# EAGLE design bootloader_burner (EAGLE 9.6.2)
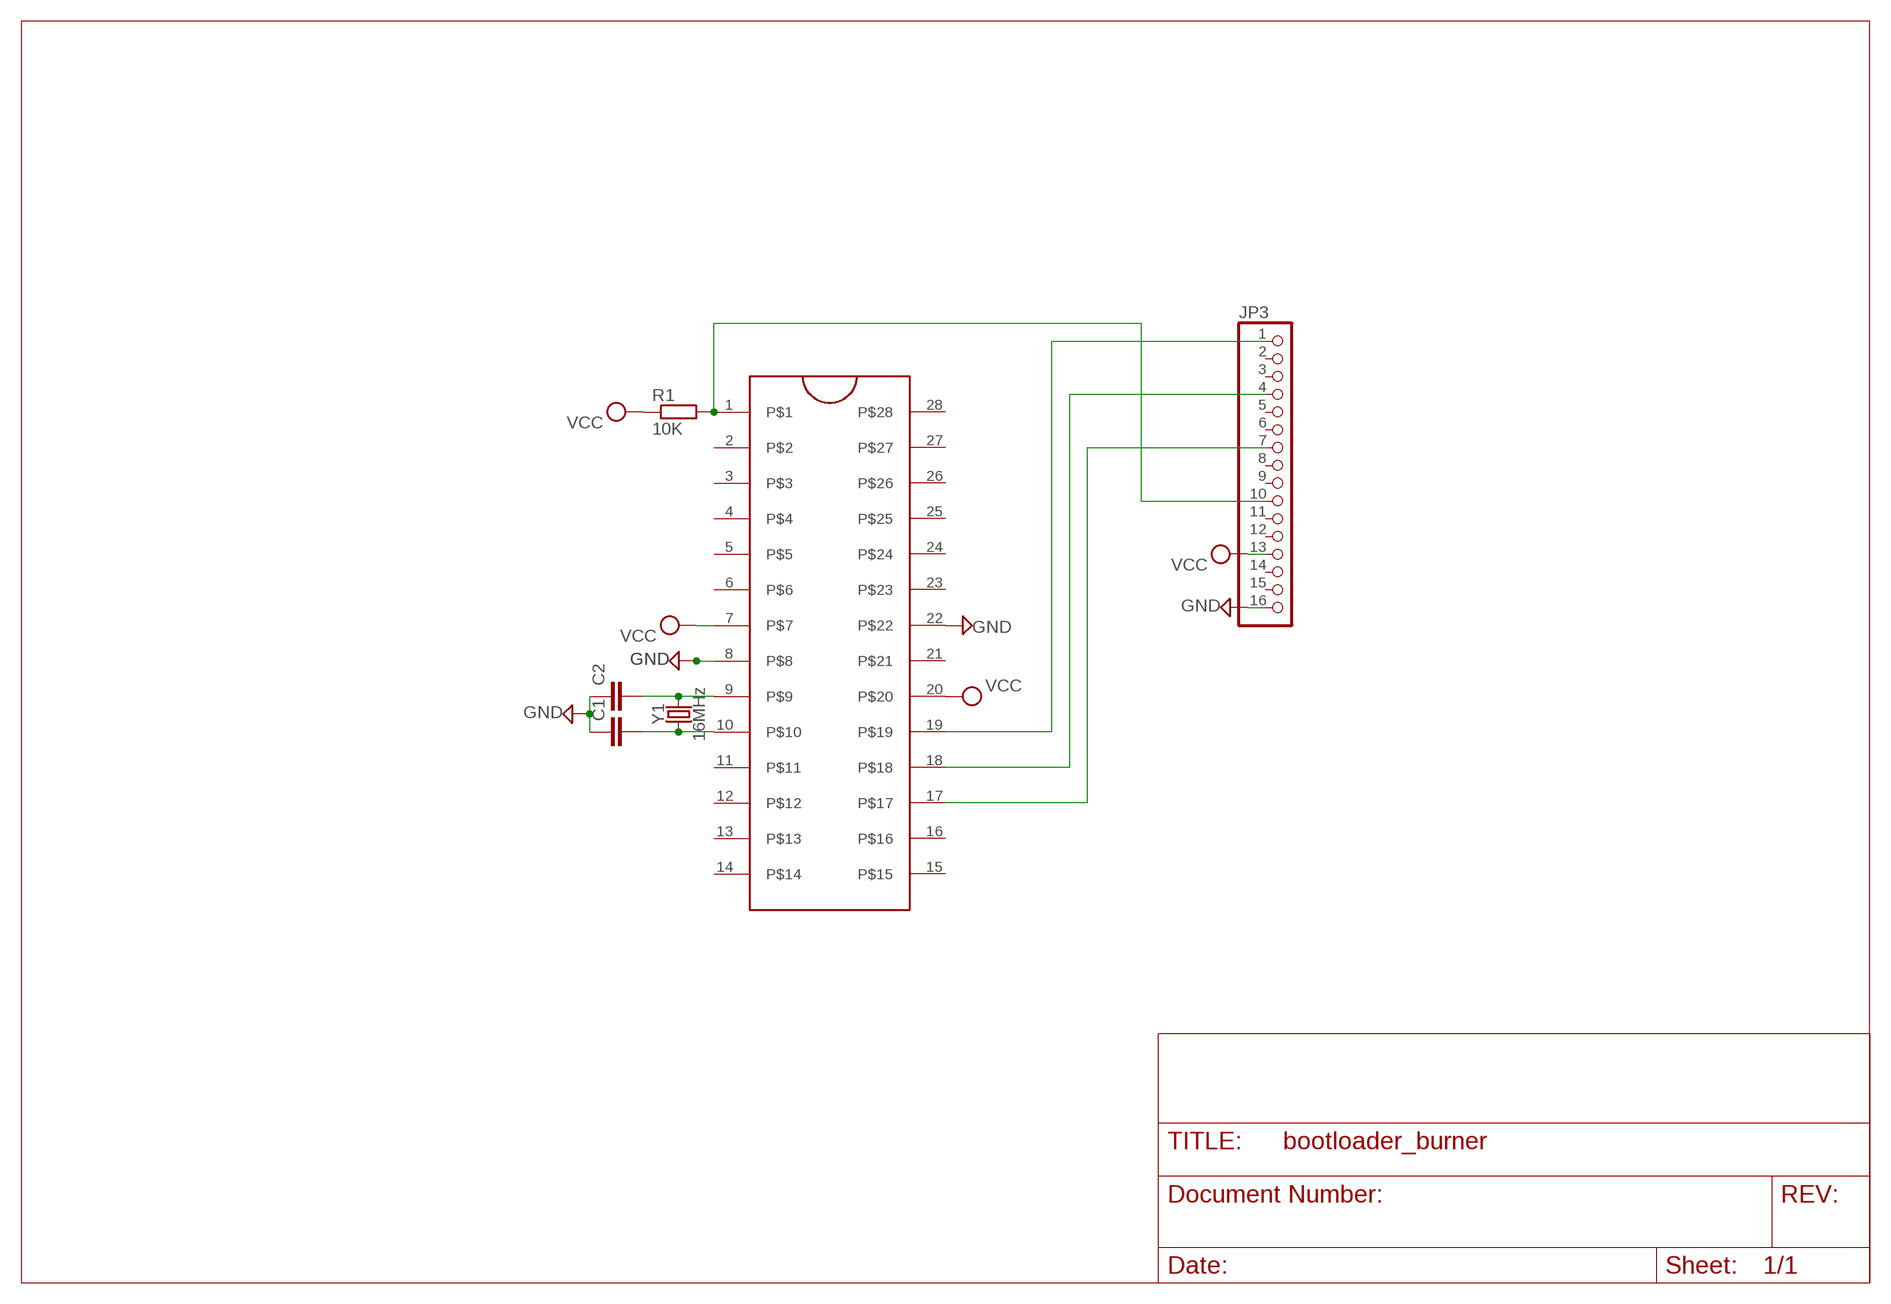
[diagram p0: schematic, sheet 1]

## Parts
C1  C-EU050-030X075  [C050-030X075]
C2  C-EU050-030X075  [C050-030X075]
J1  ZIFSOCKET-28-3"  [DIL28-3-ZIF_SOCKET]
JP3  PINHD-1X16  [1X16]
R1  10K  R-EU_0207/10  [0207/10]
Y1  16MHz  CRYSTAL-16MHZPTH-HC49US  [HC49US]

## Nets
GND: C1.1 C2.1 J1.8 J1.22 JP3.16
N$4: C2.2 J1.9 Y1.2
N$5: C1.2 J1.10 Y1.1
PIN10ARDUINO: J1.1 JP3.10 R1.2
PIN11ARDUINO: J1.17 JP3.7
PIN12ARDUINO: J1.18 JP3.4
PIN13ARDUINO: J1.19 JP3.1
VCC: J1.7 J1.20 JP3.13 R1.1
Unconnected: J1.2 J1.3 J1.4 J1.5 J1.6 J1.11 J1.12 J1.13 J1.14 J1.15 J1.16 J1.21 J1.23 J1.24 J1.25 J1.26 J1.27 J1.28 JP3.2 JP3.3 JP3.5 JP3.6 JP3.8 JP3.9 JP3.11 JP3.12 JP3.14 JP3.15

## Library data of the parts
C1 C2 = rcl:C-EU: CAPACITOR, European symbol; SPICEPREFIX: C
J1 = SparkFun-Connectors:ZIFSOCKET-28-3: ZIF Socket 28-Pin 0.3" Lever-action ZIF socket for 28-pin ICs SparkFun Products: ZIF Socket 28-Pin <https://www.sparkfun.com/products/9175>; PROD_ID: CONN-10960; SF_ID: PRT-09175
JP3 = pinhead:PINHD-1X16: PIN HEADER
R1 = rcl:R-EU_: RESISTOR, European symbol; SPICEPREFIX: R
Y1 = SparkFun-Clocks:CRYSTAL-16MHZ: 16MHz Crystal Digikey Example <http://www.digikey.com/product-search/en?keywords=535-9122-1-ND> Frequency: 16MHz Frequency Stability: ±50ppm Frequency Tolerance: ±20ppm Load Capacitance: 18pF SparkFun Products: Pro Micro -5V/16MHz <https://www.sparkfun.com/products/12640> SparkFun Serial Enabled LCD Kit <https://www.sparkfun.com/products/10097>; PROD_ID: XTAL-08181; SF_ID: COM-00536

## Net classes
0 default: clearance 0.205 mm

## Board
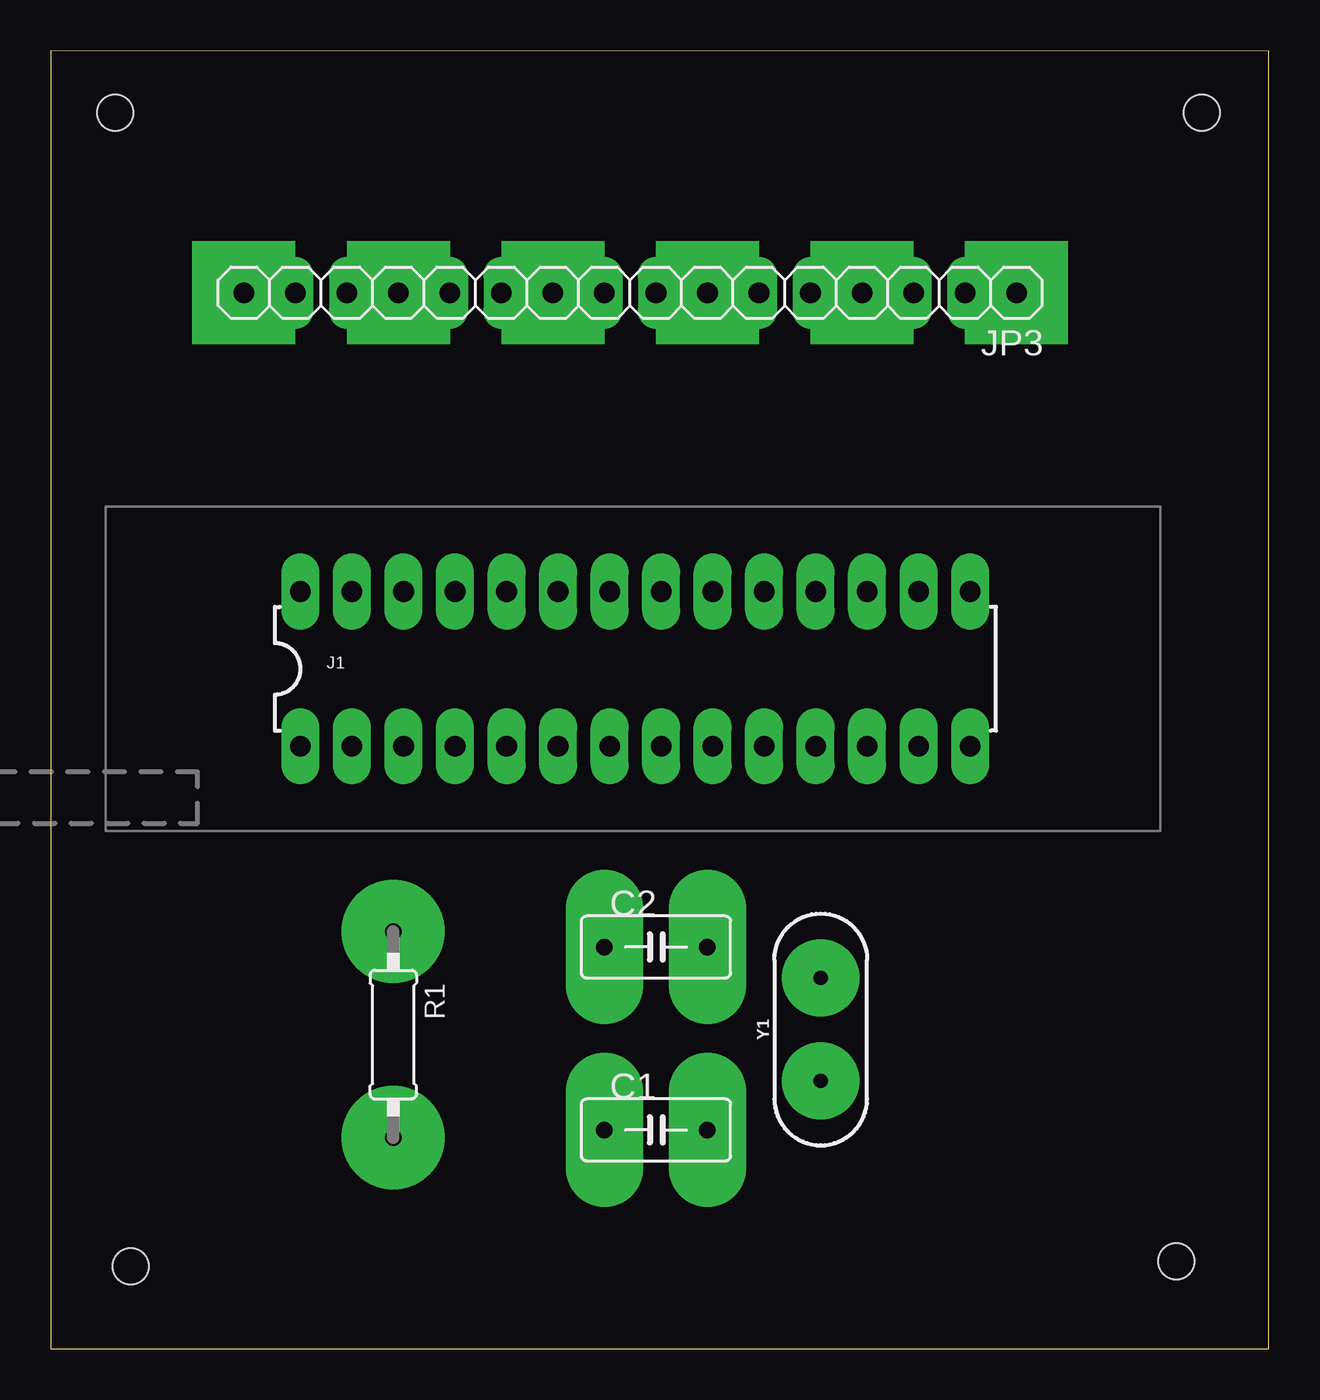
[diagram p1: board, top side]
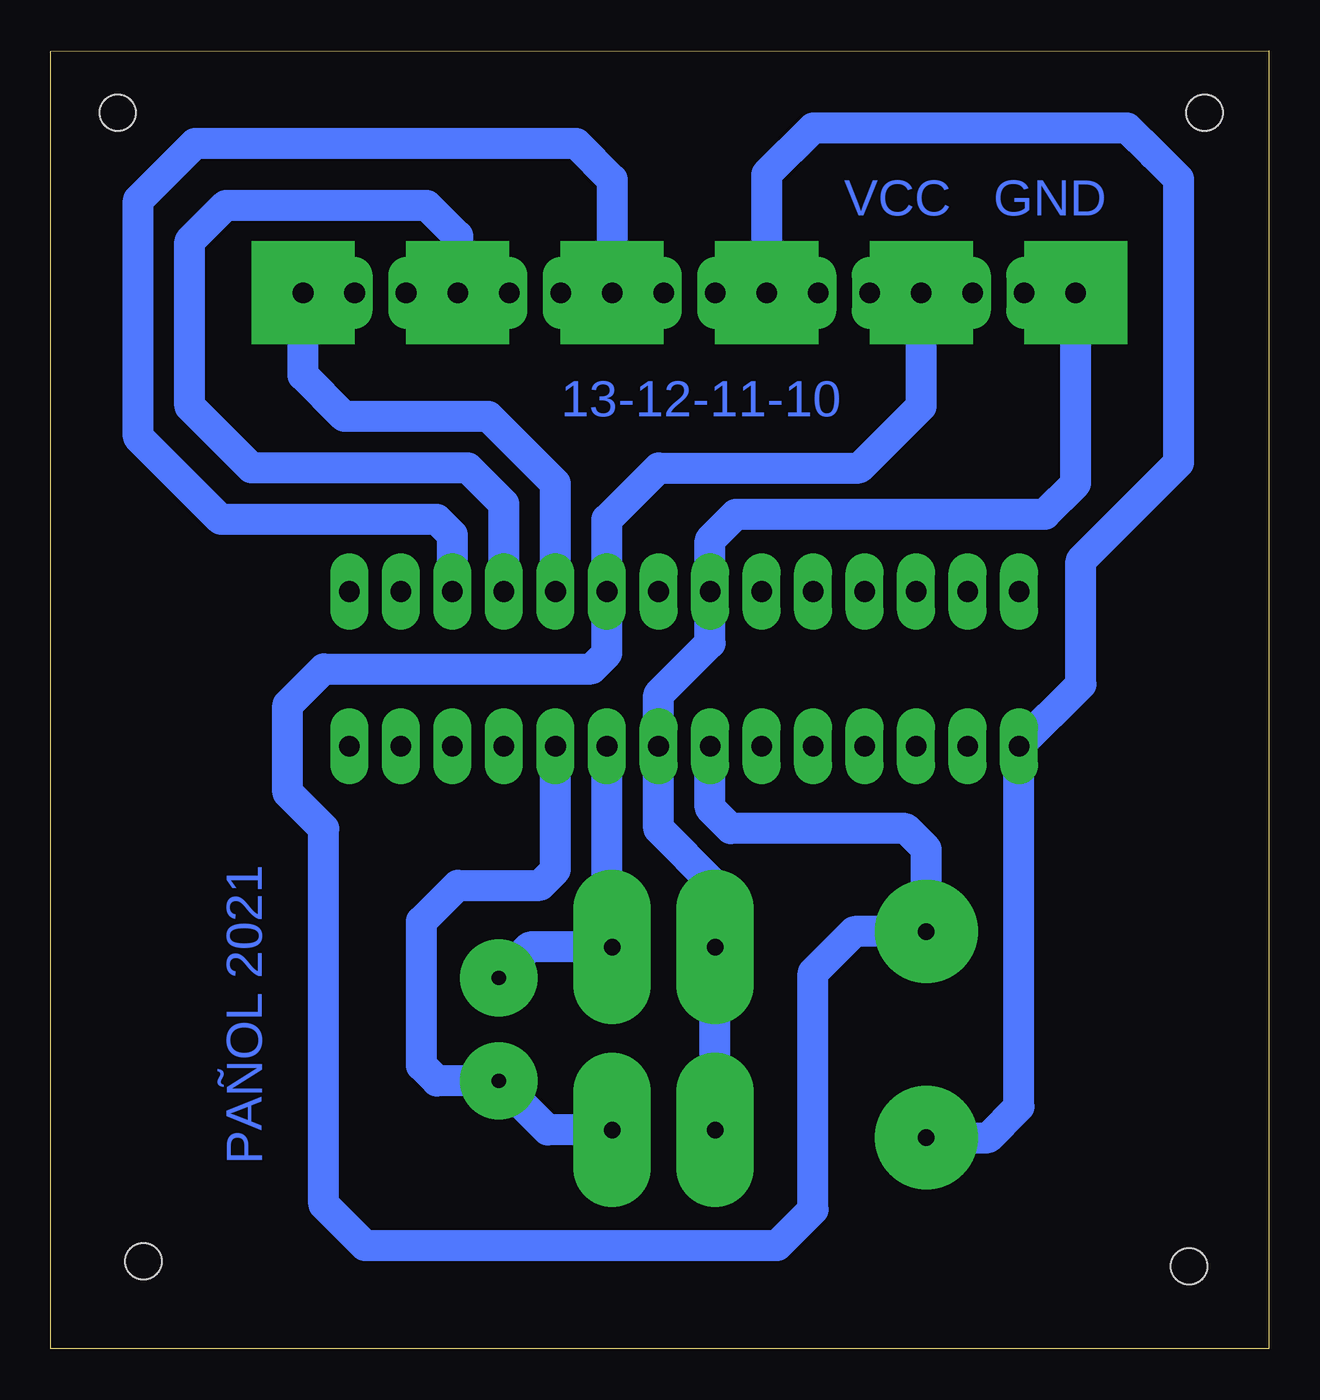
[diagram p2: board, bottom side, seen from below]

Size 60.07 x 64.01 mm. Coordinates in mm from the lower left corner, seen from the top.
Outline: 0,64.01 0,0 60.07,0 60.07,63.99 0,64.01
Copper layers (1*16): Top 0.035mm / dielectric 1.5mm / Bottom 0.035mm
Design rules "default *": minimum track width 6mil, minimum drill 0.35mm, track to track 6mil, track to pad 6mil, pad to pad 6mil, via to via 6mil, smd to smd 6mil, copper to edge 40mil, drill to drill 6mil, minimum pad ring 15mil, minimum via ring 8mil, stop-mask expansion 4mil, vias tented up to drill 0mil, thermal gap 10mil
Holes 1.78 mm at 3.17,60.96 55.5,4.32 3.94,4.06 56.77,60.96

### Footprints (pad centres in the part's own frame; a part is rotated, then mirrored left to right if it is on the bottom)
C050-030X075 = drill 0.813 pad 3.81 long: 1 -2.54,0; 2 2.54,0
DIL28-3-ZIF_SOCKET = drill 1.016 pad 1.88 long: 1 -16.51,-3.81; 2 -13.97,-3.81; 3 -11.43,-3.81; 4 -8.89,-3.81; 5 -6.35,-3.81; 6 -3.81,-3.81; 7 -1.27,-3.81; 8 1.27,-3.81; 9 3.81,-3.81; 10 6.35,-3.81; 11 8.89,-3.81; 12 11.43,-3.81; 13 13.97,-3.81; 14 16.51,-3.81; 15 16.51,3.81; 16 13.97,3.81; 17 11.43,3.81; 18 8.89,3.81; 19 6.35,3.81; 20 3.81,3.81; 21 1.27,3.81; 22 -1.27,3.81; 23 -3.81,3.81; 24 -6.35,3.81; 25 -8.89,3.81; 26 -11.43,3.81; 27 -13.97,3.81; 28 -16.51,3.81
1X16 = drill 1.016 pad 5.08 square: 1 -19.05,0; 4 -11.43,0; 7 -3.81,0; 10 3.81,0; 13 11.43,0; 16 19.05,0 | drill 1.016 long: 2 -16.51,0; 3 -13.97,0; 6 -6.35,0; 8 -1.27,0; 11 6.35,0; 12 8.89,0; 14 13.97,0; 15 16.51,0 | drill 1.016 pad 1.524 long: 5 -8.89,0; 9 1.27,0
0207/10 = drill 0.813 pad 5.08: 1 -5.08,0; 2 5.08,0
HC49US = drill 0.7 pad 3.81: 1 -2.54,0; 2 2.54,0

### Placement (x,y rotation side)
C1  29.85,10.79 0 top
C2  29.85,19.81 0 top
J1  28.83,33.53 0 top
JP3  28.57,52.07 180 top
R1  16.89,15.49 270 top
Y1  37.97,15.75 90 top

### Tracks (layer width: path | path; a pad name or v marks a point on that pad's centre or on a via)
GND
  Bottom 1.524: C1.1 C2.1 27.3,22.86 30.1,25.65 J1.8 30.1,32.26 27.56,34.8 J1.22 27.56,39.88 26.29,41.15 11.05,41.15 9.52,42.67 JP3.16
N$4
  Bottom 1.524: J1.9 32.64,23.11 32.39,22.86 C2.2 36.45,19.81 Y1.2
N$5
  Bottom 1.524: C1.2 35.56,10.79 Y1.1 41.02,13.21 41.78,13.97 41.78,21.08 40,22.86 35.94,22.86 35.18,23.62 J1.10
PIN10ARDUINO
  Bottom 1.524: R1.2 13.84,10.41 12.32,11.94 J1.1 9.27,32.77 9.27,38.86 4.44,43.69 4.44,57.68 5.67,58.9 5.69,58.9 6.98,60.2 22.48,60.2 24.76,57.91 JP3.10
PIN11ARDUINO
  Bottom 1.524: J1.17 40.26,40.13 41.02,40.89 51.69,40.89 55.75,44.96 55.75,56.64 52.96,59.44 34.16,59.44 32.39,57.66 JP3.7
PIN12ARDUINO
  Bottom 1.524: J1.18 37.72,41.66 39.5,43.43 50.17,43.43 53.21,46.48 53.21,54.61 51.44,56.39 41.53,56.39 40,54.86 JP3.4 40.26,51.82
PIN13ARDUINO
  Bottom 1.524: J1.19 35.18,42.67 38.48,45.97 45.59,45.97 47.62,48.01 JP3.1
VCC
  Bottom 1.524: J1.7 27.56,26.67 26.54,25.65 17.91,25.65 16.89,24.64 R1.1 20.45,20.57 22.48,18.54 22.48,6.86 24.26,5.08 44.58,5.08 46.61,7.11 46.61,25.65 48.39,27.43 48.39,31.75 46.61,33.53 33.4,33.53 32.64,34.29 J1.20 32.64,40.89 30.1,43.43 20.19,43.43 17.14,46.48 JP3.13

### Text on the board
Bottom: GND | VCC | 13-12-11-10 | PAÑOL 2021